# EasyEDA Pro project AC Power Switch.eprj, board 10A AC Power Switch + Fuse Detect
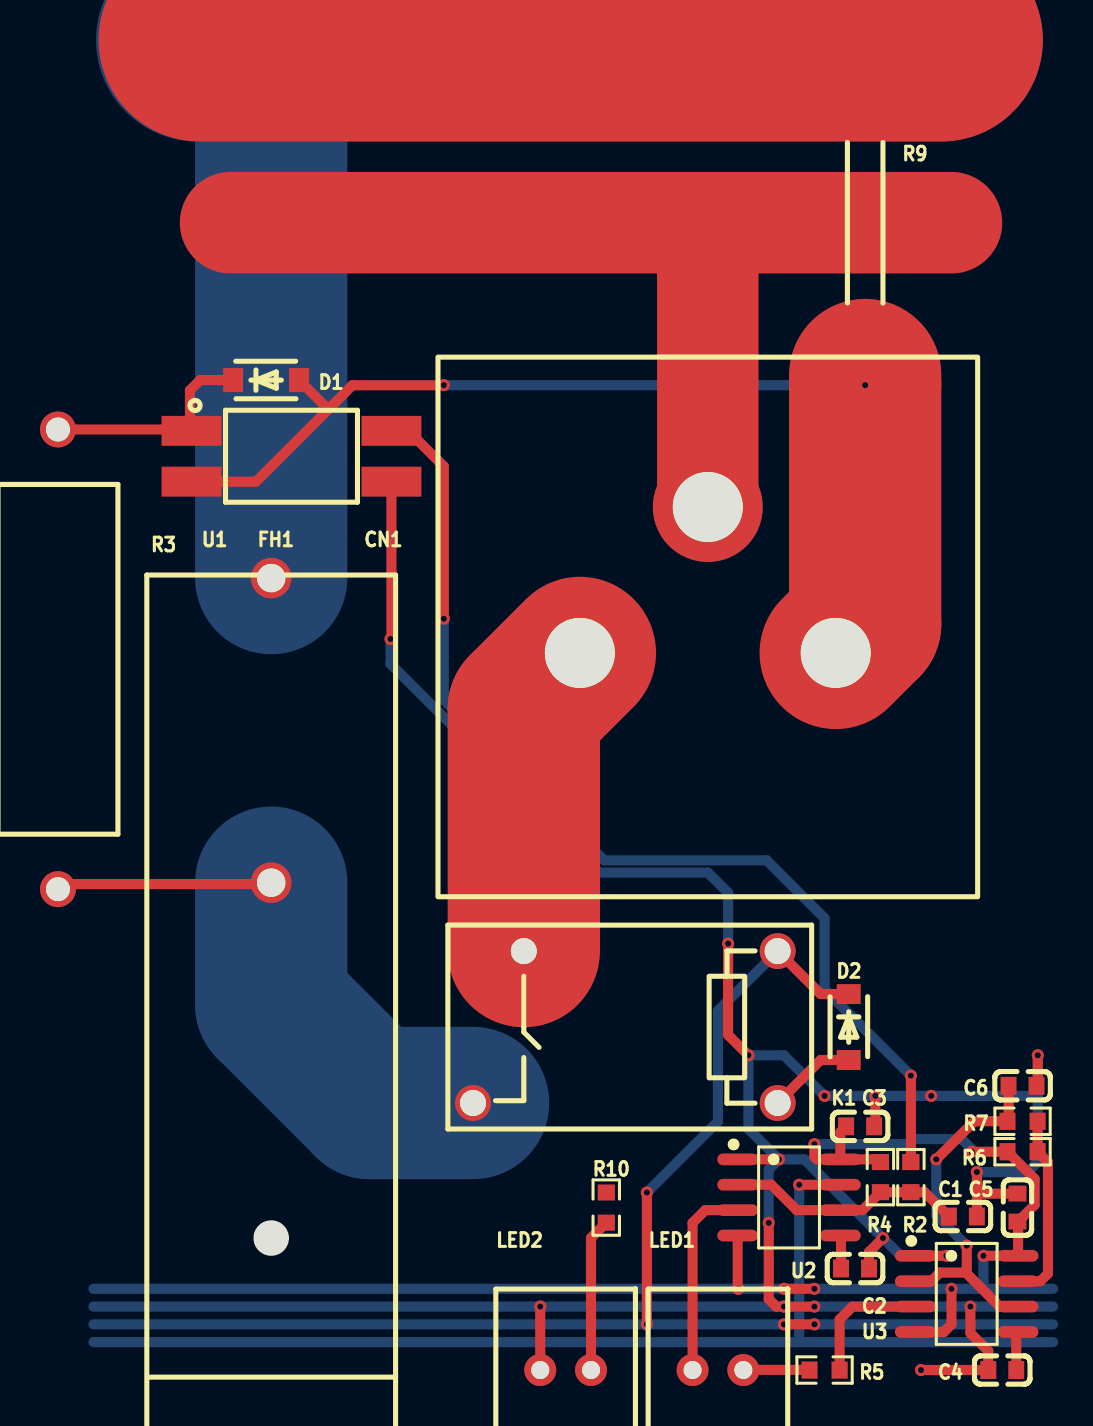
[diagram p9: board, top side]
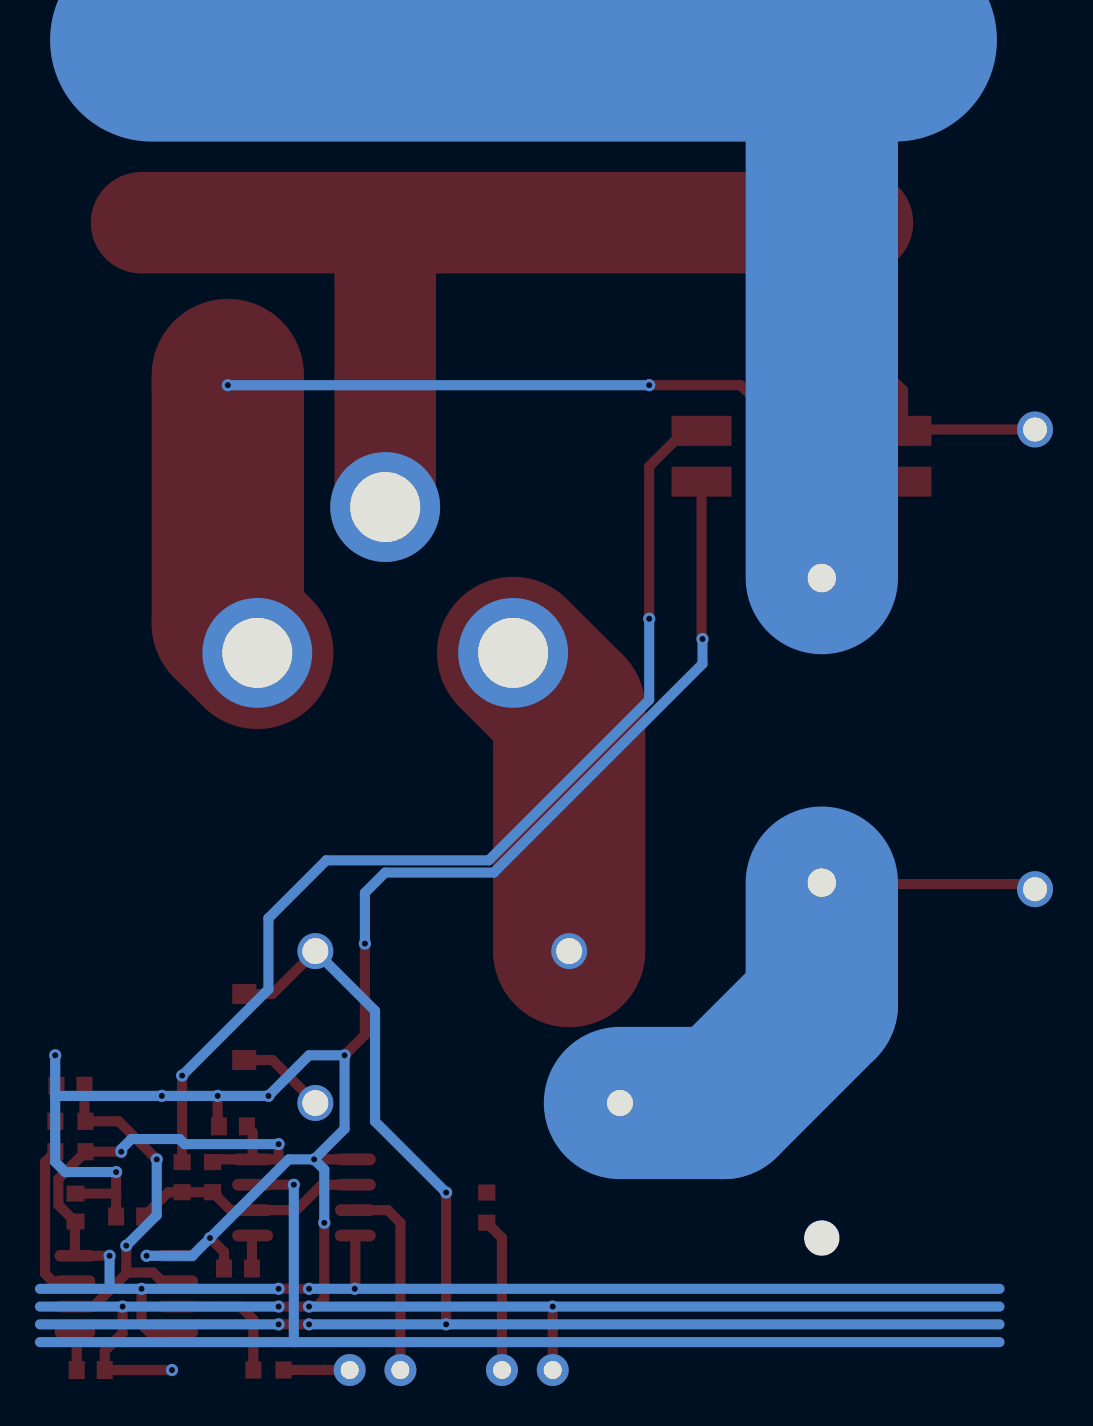
[diagram p10: board, bottom side, seen from below]

Outline 1.77 x 1.77 mm; copper layers: Top Layer, Bottom Layer. Coordinates in mm from the lower left corner of the outline.
Stack: Top Layer 0.035mm / Dielectric1 1.51mm FR4 er 4.5 / Bottom Layer 0.035mm

## Design rules (mm)
template: Custom Config
spacing copperThickness1oz (default): track to track 0.102, other pairs 0.152 to 0.3
spacing copperThickness2oz: track to track 0.203, other pairs 0.152 to 0.3
track width copperThickness1oz (default): min 0.127, default 0.254, max 12.7
track width copperThickness2oz: min 0.203, default 0.254, max 2.54
differential pair differentialPair (default): width min 0.127, default 0.254, max 2.54; gap min 0.152, default 0.152
via viaSize (default): diameter min 0.5, default 0.61, max 10; hole min 0.3, default 0.305, max 6.3

## Placement (name value [footprint] x y rotation side)
C1  10uF  [C0603]  35.49 1.96 180 top
C2  100nF  [C0603]  30.09 -0.64 180 top
C3  100nF  [C0603]  30.35 6.47 180 top
C4  100nF  [C0603]  37.46 -5.72 0 top
C5  100nF  [C0603]  38.22 2.41 270 top
C6  10uF  [C0603]  38.48 8.5 180 top
CN1  a5006310303c48c0bbc049ad0b759426  [739W-X2/32]  22.73 37.46 0 top
D1  SM4007PL  [SOD-123F_L2.8-W1.8-LS3.7-RD]  0.63 43.81 0 top
D2  SM4007PL  [SOD-123F_L2.8-W1.8-LS3.7-RD]  29.78 11.44 270 top
FH1  -  [03450101H]  0.88 26.28 90 top
K1  JZC-11FH 012-1H1L  [RELAY-TH_QLRELAY_JZC-11FH-XXX-1H1L]  18.6 11.44 180 top
LED1  MHK1560CRBTD  [LED-TH_L12.2-W6.0-P2.54]  23.24 -5.72 0 top
LED2  MHK1560CRBTD  [LED-TH_L12.2-W6.0-P2.54]  15.62 -5.72 0 top
R2  100Ω  [R0603]  32.89 3.93 270 top
R3  33kΩ  [RES-TH_BD6.0-L17.5-P21.50-D0.8]  -9.78 29.84 270 top
R4  4.7kΩ  [R0603]  31.36 3.93 90 top
R5  1kΩ  [R0603]  28.57 -5.72 0 top
R6  10kΩ  [R0603]  38.48 5.2 180 top
R7  20kΩ  [R0603]  38.48 6.73 0 top
R9  0Ω  [RES-SMD_L10.2-W1.5_HOTCU-10.2D-0R]  30.6 51.68 270 top
R10  1kΩ  [R0603]  17.65 2.41 90 top
U1  LTV-817S-TA1-C  [OPTO-SMD-4_L4.6-W6.5-P2.54-LS10.3-BL]  1.9 40 270 top
U2  NE555DR  [SOIC-8_L4.9-W3.9-P1.27-LS6.0-BL]  26.79 2.92 270 top
U3  NE555DR  [SOIC-8_L4.9-W3.9-P1.27-LS6.0-BL]  35.68 -1.91 270 top

## Footprints (pads in the part's own frame, mm; a bottom-side part is the same pattern mirrored in y, then rotated)
739W-X2/32
  round 5.5 hole 3.5: 1(6.4,-7.3) 2(-6.4,-7.3) 3(0,0)
03450101H
  round 2.032 hole 1.423: 1(7.62,0) 2(-7.62,0)
C0603
  rect 0.8x0.9 smd: 1(-0.7,0) 2(0.7,0)
LED-TH_L12.2-W6.0-P2.54
  round 1.6 hole 0.9: 1(-1.27,0) 2(1.27,0)
OPTO-SMD-4_L4.6-W6.5-P2.54-LS10.3-BL
  rect 1.5x3 smd: 1(-1.27,-5) 2(1.27,-5) 3(1.27,5) 4(-1.27,5)
R0603
  rect 0.806x0.864 smd: 1(-0.753,0) 2(0.753,0)
RELAY-TH_QLRELAY_JZC-11FH-XXX-1H1L
  round 1.8 hole 1.3: 1(-7.62,-3.8) 2(-7.62,3.8) 3(7.62,3.8) 4(5.08,-3.8)
RES-SMD_L10.2-W1.5_HOTCU-10.2D-0R
  rect 1.7x1.5 smd: 1(-5.05,0) 2(5.05,0)
RES-TH_BD6.0-L17.5-P21.50-D0.8
  round 1.8 hole 1.2: 1(-11.5,0) 2(11.5,0)
SOD-123F_L2.8-W1.8-LS3.7-RD
  rect 1x1.2 smd: 1(-1.65,0) 2(1.65,0)
SOIC-8_L4.9-W3.9-P1.27-LS6.0-BL
  oval 0.588x2.045 smd: 1(-1.905,-2.57) 2(-0.635,-2.57) 3(0.635,-2.57) 4(1.905,-2.57) 5(1.905,2.57) 6(0.635,2.57) 7(-0.635,2.57) 8(-1.905,2.57)

## Nets
As in the schematic.

## Via types
v1: diameter 0.61, hole 0.305, Top Layer to Bottom Layer, 35 vias

## Routing (per net, layer and track width the routed paths; a pad name or vN(x,y) marks a point on that pad's centre or on a via; arc(x,y) is an arc through that point)
GND: length 158.4
  Top Layer w0.508: U1.3 6.9,30.9 v1(6.85,30.86) ; v1(33.4,-5.72) C4.1 36.76,-4.77 35.87,-3.87 v1(35.87,-2.54) ; v1(34.67,0) U3.1 ; C6.1 39.24,8.57 v1(39.24,10.03) ; C2.1 30.79,0.19 v1(31.49,0.88) ; v1(31.11,8) 31.11,6.53 C3.1 ; v1(36.19,4.19) 36.19,3.11 ; 36.19,3.11 C5.1 ; 36.19,3.11 C1.1 ; v1(26.28,4.82) U2.1 ; v1(24.76,10.03) 23.74,11.04 v1(23.74,15.62) ; v1(25.78,1.65) 25.78,-2.16 26.16,-2.54 v1(26.54,-2.54) v1(28.06,-2.54) ; LED2.1 v1(14.35,-2.54)
  Bottom Layer w0.508: v1(6.85,30.86) 6.85,29.61 17.29,19.17 22.73,19.17 23.74,18.16 v1(23.74,15.62) ; 39.24,8 v1(33.9,8) v1(31.11,8) v1(28.57,8) 26.54,10.03 v1(24.76,10.03) 24.76,6.35 v1(26.28,4.82) ; 39.24,8 39.24,4.69 38.73,4.19 v1(36.19,4.19) ; 39.24,8 v1(39.24,10.03) ; v1(26.28,4.82) 27.55,4.82 v1(31.49,0.88) 32.38,0 v1(34.67,0) ; v1(26.28,4.82) 25.78,4.31 v1(25.78,1.65) ; v1(26.54,-2.54) -8.01,-2.54 ; 40,-2.54 v1(35.87,-2.54) v1(28.06,-2.54)
VCC: length 79.9
  Top Layer w0.508: v1(24.25,-1.66) 24.22,-1.63 U2.4 ; R4.2 31.23,4.82 U2.8 ; v1(36.52,0) U3.8 38.25,1.68 C5.2 38.25,1.71 39.08,2.54 39.08,3.85 R6.2 v1(35.94,5.2) ; v1(26.54,-1.66) v1(28.06,-1.66) ; C3.2 29.36,6.19 U2.8 ; U2.8 28.19,4.82 28.06,4.95 v1(28.06,5.58) ; U3.4 34.54,-3.81 34.92,-3.43 v1(34.92,-1.66)
  Bottom Layer w0.508: -8.01,-1.66 v1(24.25,-1.66) v1(26.54,-1.66) ; 36.52,-1.66 v1(34.92,-1.66) v1(28.06,-1.66) ; 36.52,-1.66 40,-1.66 ; 36.52,-1.66 v1(36.52,0) ; v1(28.06,5.58) 32.76,5.58 33.02,5.84 35.43,5.84 35.94,5.33 v1(35.94,5.2)
DET-RTN: length 52.3
  Top Layer w0.508: v1(9.52,43.56) 4.95,43.56 3.72,42.33 ; D1.2 3.72,42.37 3.72,42.33 ; 3.72,42.33 0.12,38.73 U1.2
  Top Layer w7.62: CN1.1 30.6,31.63 v1(30.6,43.56) 30.6,44.06
  Bottom Layer w0.508: v1(9.52,43.56) v1(30.6,43.56)
EARTH: length 50.3
  Top Layer w5.08: 22.73,51.68 34.92,51.68 ; 22.73,51.68 CN1.3 ; 22.73,51.68 -1.15,51.68
FUSE-DET: length 28.9
  Top Layer w0.508: FH1.2 0.81,18.59 -9.78,18.59
  Bottom Layer w7.62: K1.3 5.81,7.64 0.88,12.57 FH1.2
INTERRUPT: length 57.9
  Top Layer w0.508: U2.7 v1(27.3,3.55)
  Bottom Layer w0.508: v1(27.3,3.55) 27.3,-4.32 ; 27.3,-4.32 40,-4.32 ; 27.3,-4.32 -8.01,-4.32
LIVE: length 62.9
  Bottom Layer w7.62: FH1.1 0.88,59.56
  Bottom Layer w10.16: -2.8,60.83 34.41,60.83
NEUTRAL: length 37.1
  Top Layer w10.16: -2.67,60.83 34.41,60.83
RELAY-POWER: length 73.8
  Top Layer w0.508: v1(19.68,3.16) v1(19.68,-3.43) ; v1(28.06,-3.43) v1(26.54,-3.43) ; D2.1 28.37,13.09 K1.1
  Bottom Layer w0.508: -8.01,-3.43 v1(19.68,-3.43) v1(26.54,-3.43) ; v1(19.68,3.16) 23.24,6.72 23.24,12.25 K1.1 ; 40,-3.43 v1(28.06,-3.43)
SWITCH: length 4.4
  Top Layer w0.508: K1.2 28.37,9.79 29.78,9.79
$1N254: length 16.1
  Top Layer w7.62: CN1.2 13.52,27.36 K1.4
$1N1155: length 1.7
  Top Layer w0.508: C2.2 29.39,0.98 U2.5
$1N1159: length 12.1
  Top Layer w0.508: 32.83,3.12 R2.2 ; R2.2 R4.1 30.47,2.28 U2.6 27.17,2.28 25.9,3.55 U2.2 ; R2.2 33.57,3.18 C1.2
$1N1161: length 9.9
  Top Layer w0.508: U2.3 22.6,2.28 21.97,1.65 LED1.1
$1N1162: length 3.3
  Top Layer w0.508: LED1.2 24.52,-5.71 27.81,-5.71 R5.1
$1N1169: length 1.9
  Top Layer w0.508: C4.2 38.16,-3.91 U3.5
$1N1170: length 18.5
  Top Layer w0.508: v1(35.68,0.5) 35.68,-0.79 35.63,-0.84 ; C6.2 37.78,6.78 R7.1 36.06,6.73 v1(34.16,4.82) ; 38.25,-2.54 37.33,-2.54 35.63,-0.84 ; 35.63,-0.84 34.34,-0.84 33.9,-1.27 U3.2
  Bottom Layer w0.508: v1(35.68,0.5) 34.16,2.03 v1(34.16,4.82)
$1N1173: length 52.6
  Top Layer w0.508: v1(9.52,31.87) 9.52,39.49 7.74,41.27 U1.4 ; R2.1 v1(32.89,9.01)
  Bottom Layer w0.508: v1(32.89,9.01) 28.57,13.33 28.57,16.89 25.67,19.78 17.55,19.78 9.52,27.81 v1(9.52,31.87)
$1N1174: length 6.6
  Top Layer w0.508: 33.11,-2.54 29.97,-2.54 29.32,-3.19 R5.2
$1N1176: length 9.5
  Top Layer w0.508: R7.2 R6.1 39.75,4.69 39.75,-0.89 39.37,-1.27 U3.7
$1N1181: length 11
  Top Layer w0.508: D1.1 -2.67,43.81 -3.18,43.3 -3.18,41.35 -3.17,41.34 ; -3.17,41.34 U1.1 ; -3.17,41.34 R3.1
$1N3824: length 7.7
  Top Layer w0.508: LED2.2 16.89,0.89 R10.1
